# EAGLE design plugV15-pth (EAGLE 7.5.0)
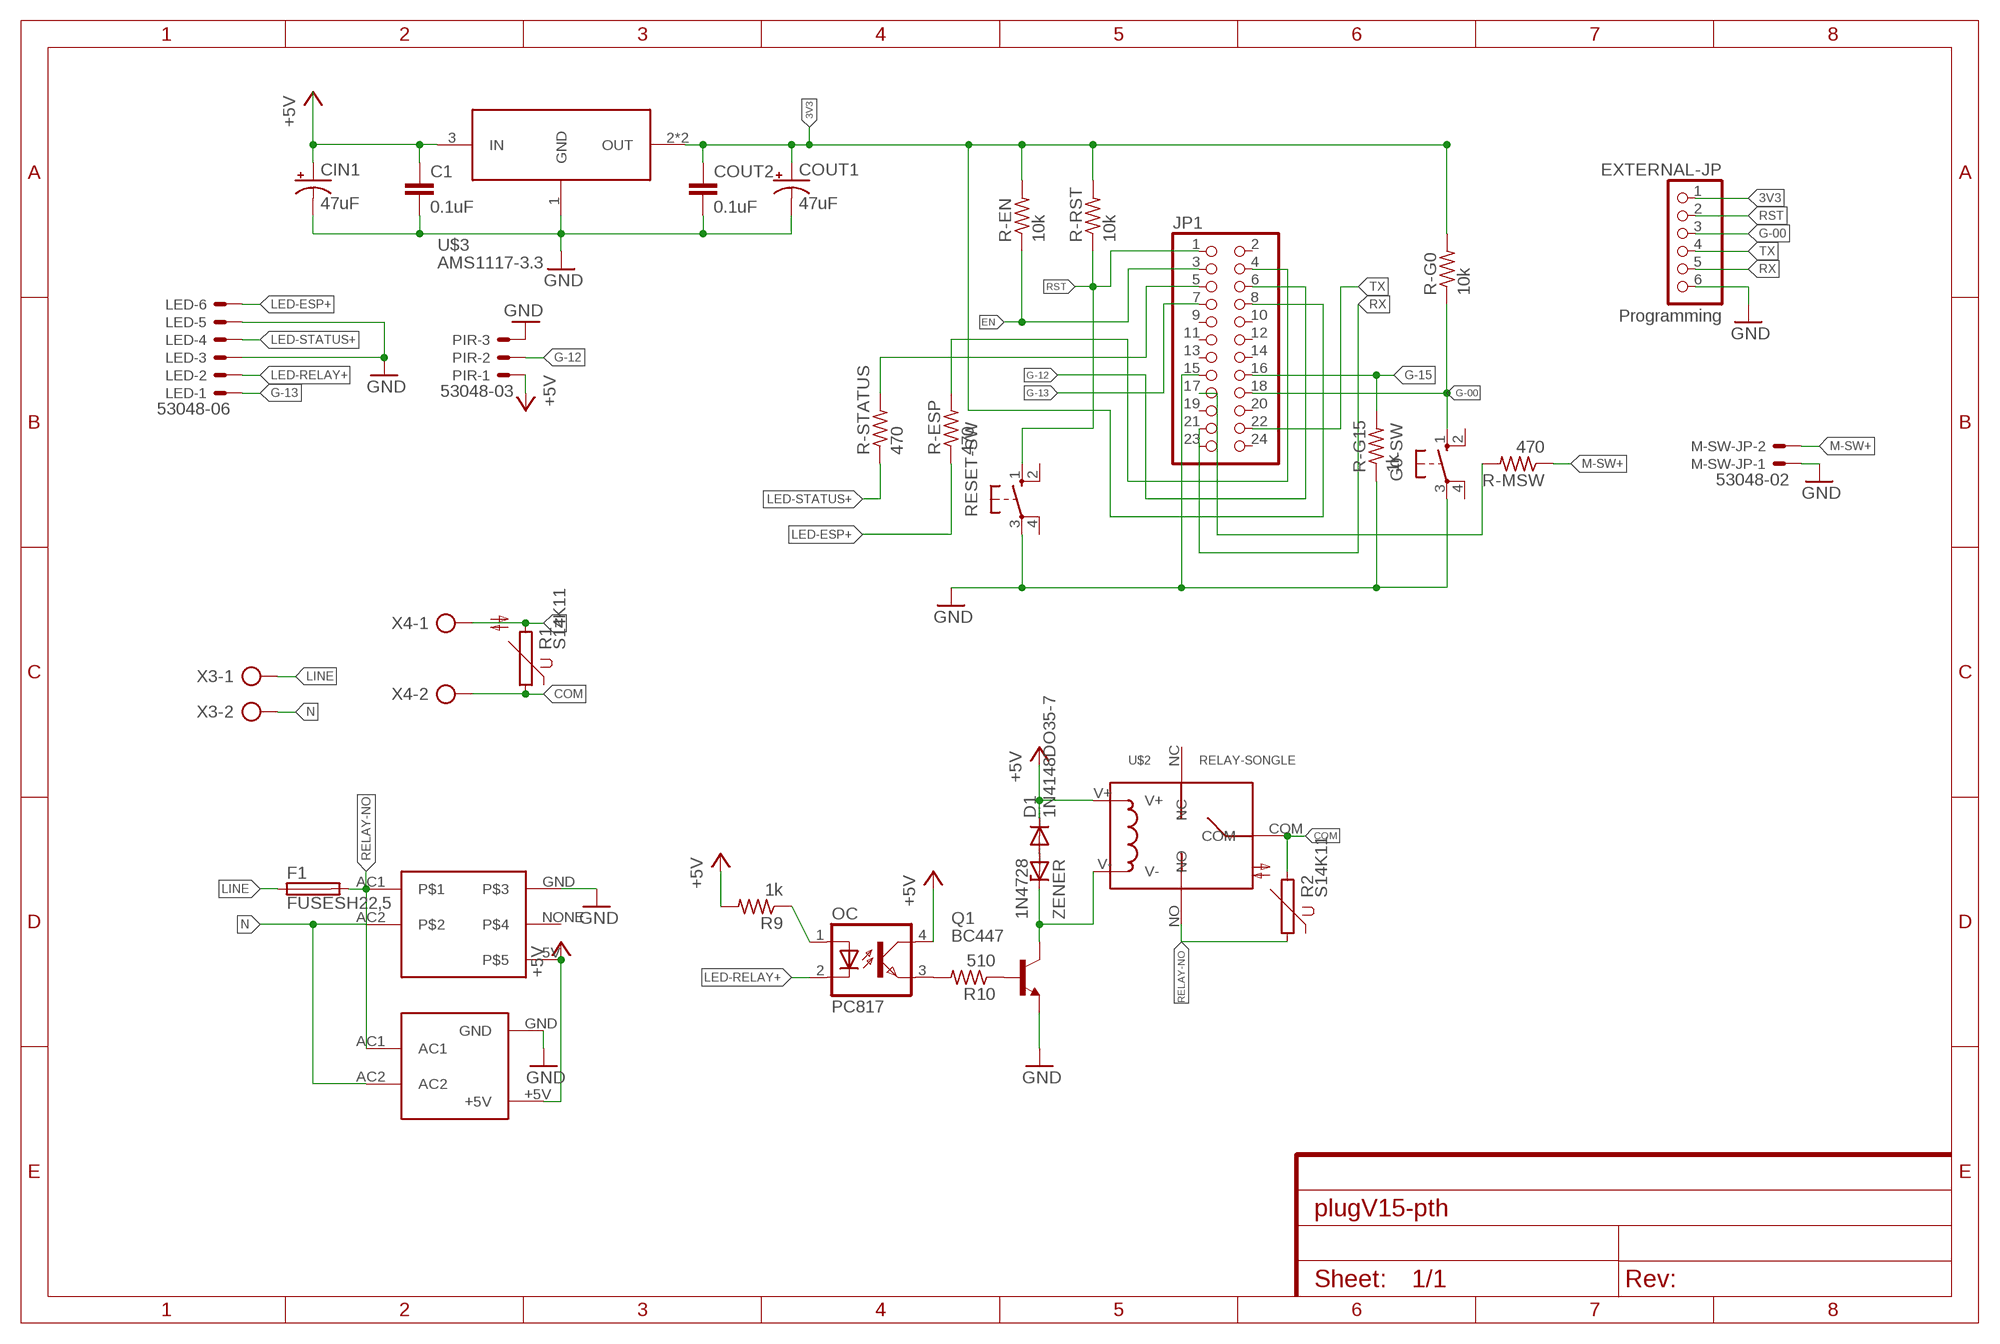
[diagram p0: schematic, sheet 1]

## Parts
C1  0.1uF  C-EU050-024X044  [C050-024X044]
CIN1  47uF  CPOL-USE2.5-5  [E2,5-5]
COUT1  47uF  CPOL-USE2.5-5  [E2,5-5]
COUT2  0.1uF  C-EU050-024X044  [C050-024X044]
D1  1N4148DO35-7  [DO35-7]
EXTERNAL-JP  Programming  PINHD-1X6  [1X06]
F1  FUSESH22,5  [SH22,5]
G0-SW  10-XX  [B3F-10XX]
JP1  PINHD-2X12  [2X12]
LED  53048-06  [53048-06]
M-SW-JP  53048-02  [53048-02]
OC  PC817  [DIL04]
PIR  53048-03  [53048-03]
Q1  BC447  [TO92-EBC]
R1  S14K11  [S14K11]
R2  S14K11  [S14K11]
R9  1k  R-US_0207/10  [0207/10]
R10  510  R-US_0207/10  [0207/10]
R-EN  10k  R-US_0207/10  [0207/10]
R-ESP  470  R-US_0207/10  [0207/10]
R-G0  10k  R-US_0207/10  [0207/10]
R-G15  1k  R-US_0207/10  [0207/10]
R-MSW  470  R-US_0207/10  [0207/10]
R-RST  10k  R-US_0207/10  [0207/10]
R-STATUS  470  R-US_0207/10  [0207/10]
RESET-SW  10-XX  [B3F-10XX]
U$1  HLK-PM01  [HLK-PM01]
U$2  RELAY-SONGLE  [RELAY-SONGLE]
U$3  AMS1117-3.3  [SOT-223]
U$4  POWERSUPPLY-5V-700MA  [POWERSUPPLY-5V-700MA]
X3  AK300/2  [AK300/2]
X4  AK300/2  [AK300/2]
ZENER  1N4728  [DO41Z10]

## Nets
3V3: COUT1.+ COUT2.1 EXTERNAL-JP.1 JP1.8 R-EN.2 R-G0.2 R-RST.2 U$3.2(OUT) U$3.4(OUT)
+5V: C1.1 CIN1.+ D1.C OC.4(COL) PIR.1 R9.2 U$1.+5V U$2.V+ U$3.3(IN) U$4.5V
COM: R1.1 R2.2 U$2.COM X4.2
EN: JP1.3 R-EN.1
G-00: EXTERNAL-JP.3 G0-SW.1(S) JP1.18 R-G0.1
G-12: JP1.6 PIR.2
G-13: JP1.7 LED.1
G-15: JP1.16 R-G15.2
GND: C1.2 CIN1.- COUT1.- COUT2.2 EXTERNAL-JP.6 G0-SW.3(P) JP1.15 LED.3 LED.5 M-SW-JP.1 PIR.3 Q1.E R-G15.1 RESET-SW.3(P) U$1.GND U$3.1(GND) U$4.GND
LED-ESP+: LED.6 R-ESP.1
LED-RELAY+: LED.2 OC.2(C)
LED-STATUS+: LED.4 R-STATUS.1
LINE: F1.1 X3.1
M-SW+: M-SW-JP.2 R-MSW.1
N: R1.2 U$1.AC2 U$4.AC2 X3.2 X4.1
N$1: OC.3(EMIT) R10.2
N$2: Q1.B R10.1
N$4: JP1.4 R-ESP.2
N$7: JP1.17 R-MSW.2
N$8: JP1.5 R-STATUS.2
N$13: OC.1(A) R9.1
N$16: D1.A ZENER.A
N$17: Q1.C U$2.V- ZENER.C
RELAY-NO: F1.2 R2.1 U$1.AC1 U$2.NO U$4.AC1
RST: EXTERNAL-JP.2 JP1.1 R-RST.1 RESET-SW.1(S)
RX: EXTERNAL-JP.5 JP1.21
TX: EXTERNAL-JP.4 JP1.22
Unconnected: G0-SW.2(S1) G0-SW.4(P1) JP1.2 JP1.9 JP1.10 JP1.11 JP1.12 JP1.13 JP1.14 JP1.19 JP1.20 JP1.23 JP1.24 RESET-SW.2(S1) RESET-SW.4(P1) U$2.NC U$4.NONE

## Library data of the parts
C1 COUT2 = rcl:C-EU: CAPACITOR, European symbol
CIN1 COUT1 = rcl:CPOL-US: POLARIZED CAPACITOR, American symbol
D1 = diode:1N4148: DIODE high speed (Philips)
EXTERNAL-JP = pinhead:PINHD-1X6: PIN HEADER
F1 = fuse:FUSE: Fuse; OC_FARNELL: unknown; OC_NEWARK: unknown
G0-SW RESET-SW = switch-omron:10-XX: OMRON SWITCH; MPN: B3F-1000; OC_FARNELL: 176432; OC_NEWARK: 36M3542
JP1 = pinhead:PINHD-2X12: PIN HEADER
LED = con-molex:53?-06: CONNECTOR wire to board 1.25 mm (.049 inch) pitch header; MF: WALDOM/MOLEX; MPN: 53048-0610; OC_FARNELL: 1012260; OC_NEWARK: 38C9911
M-SW-JP = con-molex:53?-02: CONNECTOR wire to board 1.25 mm (.049 inch) pitch header; MF: MOLEX; MPN: 53048-0210; OC_FARNELL: 1012259; OC_NEWARK: 57H4718
OC = optocoupler:PC817: SHARP OPTO COUPLER; MPN: PC817X4J000F; OC_FARNELL: 9707727; OC_NEWARK: 97K7059
PIR = con-molex:53?-03: CONNECTOR wire to board 1.25 mm (.049 inch) pitch header; MF: WALDOM/MOLEX; MPN: 53048-0310; OC_FARNELL: 9732918; OC_NEWARK: 38C9908
Q1 = transistor-npn:BC447*: NPN Transistor
R1 R2 = varistor:S14K11: VARISTOR
R9 R10 R-EN R-ESP R-G0 R-G15 R-MSW R-RST R-STATUS = rcl:R-US_: RESISTOR, American symbol
U$1 = HLK-PM01:HLK-PM01
U$2 = Seeed-OPL-Relay:RELAY-SONGLE
U$3 = AMS1117-3.3:AMS1117-3.3: 1A LOW DROPOUT VOLTAGE REGULATOR
U$4 = PowerSupply-5V-700mA:POWERSUPPLY-5V-700MA
X3 X4 = con-ptr500:AK300/2: CONNECTOR; OC_FARNELL: unknown; OC_NEWARK: unknown
ZENER = diode:1N4728: Z DIODE 3.3 V, 1W, 5 percent

## Net classes
0 default: width 0.305 mm
1 tong: width 0.61 mm

## Board
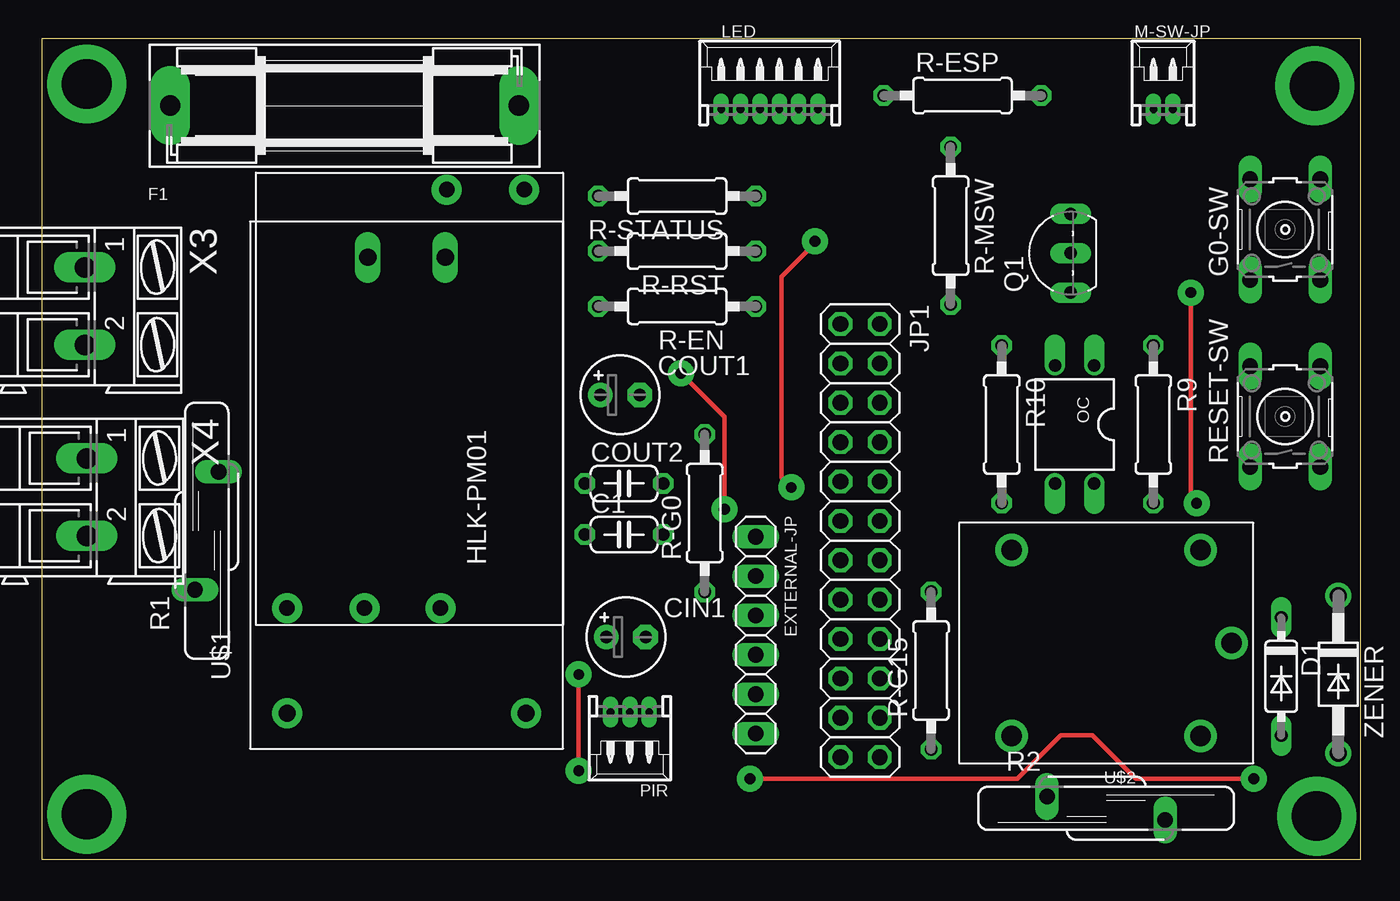
[diagram p1: board, top side]
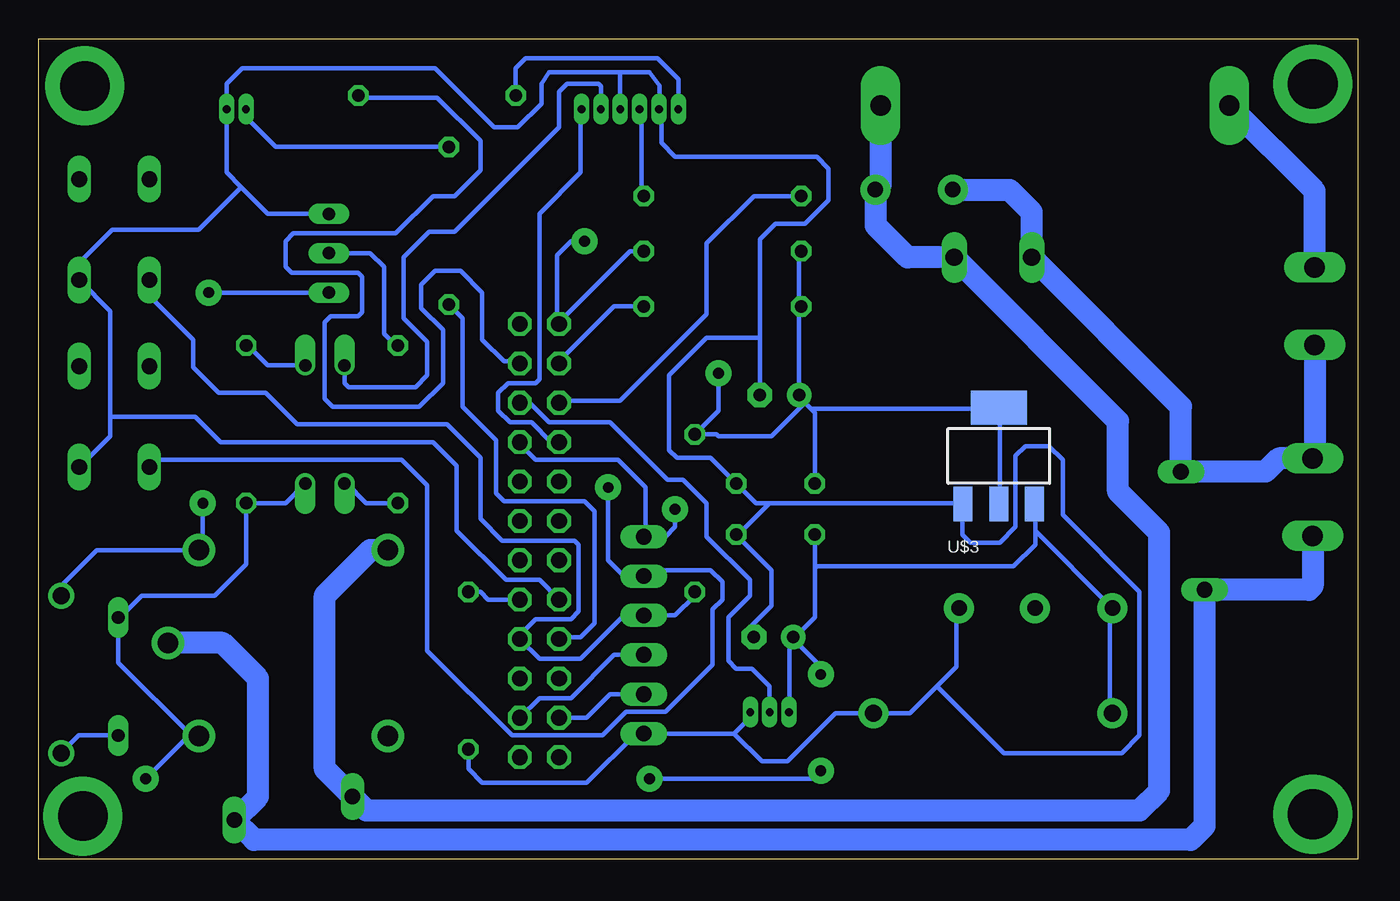
[diagram p2: board, bottom side, seen from below]

Size 85.14 x 52.95 mm. Coordinates in mm from the lower left corner, seen from the top.
Outline: 0,0 85.14,0 85.14,52.95 0,52.95 0,0
Copper layers (1*16): Top 0.035mm / dielectric 1.5mm / Bottom 0.035mm
Design rules "default": minimum track width 10mil, minimum drill 24mil, track to track 8mil, track to pad 8mil, pad to pad 8mil, via to via 8mil, smd to smd 8mil, copper to edge 40mil, drill to drill 8mil, minimum pad ring 10mil, minimum via ring 8mil, stop-mask expansion 4mil, vias tented up to drill 0mil, thermal gap 10mil

### Footprints (pad centres in the part's own frame; a part is rotated, then mirrored left to right if it is on the bottom)
C050-024X044 = drill 0.813 octagon: 1 -2.54,0; 2 2.54,0
E2,5-5 = drill 0.813 pad 1.6: + -1.27,0 | drill 0.813 pad 1.6 octagon: - 1.27,0
DO35-7 = drill 0.813 long: A 3.81,0; C -3.81,0
1X06 = drill 1.016 long: 1 -6.35,0; 2 -3.81,0; 3 -1.27,0; 4 1.27,0; 5 3.81,0; 6 6.35,0
SH22,5 = drill 1.321 pad 2.54 long: 1 -11.252,0; 2 11.252,0
B3F-10XX = drill 1.016 long: 1 -3.251,2.261; 2 3.251,2.261; 3 -3.251,-2.261; 4 3.251,-2.261
2X12 = drill 1.016 octagon: 1 -13.97,-1.27; 2 -13.97,1.27; 3 -11.43,-1.27; 4 -11.43,1.27; 5 -8.89,-1.27; 6 -8.89,1.27; 7 -6.35,-1.27; 8 -6.35,1.27; 9 -3.81,-1.27; 10 -3.81,1.27; 11 -1.27,-1.27; 12 -1.27,1.27; 13 1.27,-1.27; 14 1.27,1.27; 15 3.81,-1.27; 16 3.81,1.27; 17 6.35,-1.27; 18 6.35,1.27; 19 8.89,-1.27; 20 8.89,1.27; 21 11.43,-1.27; 22 11.43,1.27; 23 13.97,-1.27; 24 13.97,1.27
53048-06 = drill 0.5 pad 0.698 long: 1 3.125,-1.25; 2 1.875,-1.25; 3 0.625,-1.25; 4 -0.625,-1.25; 5 -1.875,-1.25; 6 -3.125,-1.25
53048-02 = drill 0.5 pad 0.698 long: 1 0.625,-1.25; 2 -0.625,-1.25
DIL04 = drill 0.813 offset: 1 -1.27,-3.81; 2 1.27,-3.81; 3 1.27,3.81; 4 -1.27,3.81
53048-03 = drill 0.5 pad 0.698 long: 1 1.25,-1.25; 2 0,-1.25; 3 -1.25,-1.25
TO92-EBC = drill 0.813 long: B 0,-1.27; C -2.54,-1.27; E 2.54,-1.27
S14K11 = drill 1.016 long: 1 -0.762,-3.81; 2 0.762,3.81
0207/10 = drill 0.813 octagon: 1 -5.08,0; 2 5.08,0
HLK-PM01 = drill 1.1 pad 1.93: +5V 15.19,-7.76; GND 15.19,7.64 | drill 1.1 long: AC1 -14.21,2.44; AC2 -14.21,-2.56
RELAY-SONGLE = drill 1.3 pad 2.1: COM -8.1,0; NC 6.1,6; NO 6.1,-6; V+ -6.1,6; V- -6.1,-6
SOT-223 = smd 1.219 x 2.235: 1 -2.381,-3.099; 2 -0.07,-3.099; 3 2.241,-3.099 | smd 3.6 x 2.2: 4 -0.07,3.099
POWERSUPPLY-5V-700MA = drill 1 pad 1.93: 5V 13.5,-7.9; AC1 -13.5,7.4; AC2 -13.5,2.4; GND 13.5,2; NONE 13.5,-2.9
AK300/2 = drill 1.321 long: 1 -2.515,0; 2 2.489,0
DO41Z10 = drill 1.118: A 5.08,0; C -5.08,0

### Placement (x,y rotation side)
C1  37.59,20.95 0 top
CIN1  37.72,14.35 0 top
COUT1  37.34,29.97 0 top
COUT2  37.59,24.26 0 top
D1  80.01,11.81 270 top
EXTERNAL-JP  46.1,14.48 270 top
F1  19.56,48.64 0 top
G0-SW  80.26,40.64 90 top
JP1  52.83,20.57 270 top
LED  46.99,49.66 0 top
M-SW-JP  72.39,49.66 0 top
OC  66.67,28.07 180 top
PIR  37.97,8.25 180 top
Q1  65.15,39.12 90 top
R1  10.67,21.21 0 top
R2  68.71,3.3 270 top
R9  71.75,28.07 270 top
R10  61.98,28.07 270 top
R-EN  41.02,35.69 180 top
R-ESP  59.44,49.28 0 top
R-G0  42.8,22.35 90 top
R-G15  57.4,12.19 90 top
R-MSW  58.67,40.89 270 top
R-RST  41.02,39.24 180 top
R-STATUS  41.02,42.8 180 top
RESET-SW  80.26,28.57 90 top
U$1  23.62,24.64 270 top
U$2  68.71,13.97 180 top
U$3  23.11,26.04 0 bottom
U$4  23.75,29.72 270 top
X3  2.79,35.69 270 top
X4  2.92,23.37 270 top
ZENER  83.69,11.94 270 top

### Tracks (layer width: path | path; a pad name or v marks a point on that pad's centre or on a via)
3V3  (via drill 0.7 pad 1.68)
  Top 0.305: v44.07,22.61 44.07,28.57 v41.27,31.37
  Bottom 0.305: U$3.2 23.11,22.99 23.11,29.08 U$3.4 23.37,29.08 35.31,29.08 | 36.07,35.69 36.07,39.24 R-RST.2 | COUT2.1 35.05,28.83 35.31,29.08 | 35.69,29.46 36.07,29.84 COUT1.+ 36.07,35.69 | 35.69,29.46 35.31,29.08 | 36.07,35.69 R-EN.2 | 35.69,29.46 37.85,27.3 41.27,27.3 41.4,27.43 R-G0.2 41.27,28.96 v41.27,31.37 | JP1.8 54.1,26.8 53.09,25.78 47.75,25.78 45.97,24 45.97,20.95 EXTERNAL-JP.1 44.7,20.83 44.07,21.46 v44.07,22.61
+5V  (via drill 0.7 pad 1.68)
  Top 0.305: v34.67,11.94 v34.67,5.71 | v45.72,5.21 62.99,5.21 65.79,8 67.82,8 70.61,5.21 v78.23,5.21
  Bottom 0.305: CIN1.+ 36.58,14.35 34.67,12.45 v34.67,11.94 | 35.05,18.8 35.05,15.62 36.32,14.35 CIN1.+ | 35.05,18.8 C1.1 | 20.83,21.21 20.83,22.73 U$3.3 | 20.83,21.21 16,16.38 U$4.5V 16,16.13 16,9.52 U$1.+5V | v34.67,5.71 35.18,5.21 v45.72,5.21 | v78.23,5.21 75.47,7.97 U$2.V+ 75.28,7.97 80.01,12.7 D1.C 79.88,15.62 78.49,17.02 73.79,17.02 71.75,19.05 R9.2 69.22,22.99 OC.4 | PIR.1 36.7,9.52 36.7,13.72 36.45,13.97 CIN1.+ | 20.83,21.21 20.83,20.32 22.23,18.92 34.92,18.92 35.05,18.8
COM
  Bottom 1.422: X4.2 2.92,17.65 3.17,17.4 R1.1 9.91,2.16 10.79,1.27 71.25,1.27 R2.2 70.99,4.06 70.99,11.68 73.28,13.97 U$2.COM
EN
  Bottom 0.305: R-EN.1 48.01,35.69 51.56,32.13 JP1.3
G-00
  Bottom 0.305: G0-SW.1 77.98,37.36 77.98,36.32 75.18,33.53 75.18,31.75 73.53,30.1 70.48,30.1 68.45,28.07 58.8,28.07 56.64,25.91 56.64,21.97 55.24,20.57 50.55,20.57 50.29,20.32 50.29,16 50.8,15.49 53.09,15.49 54.1,14.48 JP1.18 52.83,12.95 50.16,12.95 47.37,15.75 EXTERNAL-JP.3 44.07,15.75 42.8,17.02 R-G0.1
G-12
  Bottom 0.305: PIR.2 37.97,11.18 39.12,12.32 40.13,12.32 40.64,12.83 40.64,15.62 39.24,17.02 39.24,18.03 42.04,20.83 42.04,22.99 43.56,24.51 44.58,24.51 48.26,28.19 52.2,28.19 53.47,29.46 JP1.6
G-13
  Bottom 0.305: 50.29,48.39 LED.1 50.16,48.36 50.16,44.32 52.83,41.66 52.83,30.99 53.09,30.73 54.86,30.73 55.5,30.1 55.5,28.96 54.74,28.19 53.34,28.19 52.07,26.92 JP1.7
G-15
  Bottom 0.305: JP1.16 56.13,16.76 56.64,17.27 R-G15.2
GND
  Bottom 0.305: 40.26,8.13 EXTERNAL-JP.6 46.61,8.13 49.78,4.95 56.52,4.95 57.4,5.84 R-G15.1 | 40.26,8.13 39.37,9.02 | 39.37,9.02 39.22,9.16 PIR.3 39.37,9.02 | 72.9,48.39 M-SW-JP.1 | RESET-SW.3 82.3,25.53 80.52,27.3 80.52,28.57 | 80.52,28.57 80.52,35.38 G0-SW.3 82.53,38.51 80.39,40.64 74.8,40.64 72.07,43.37 | COUT1.- 38.61,33.66 | 38.61,33.66 38.61,40.01 37.59,41.02 35.69,41.02 34.16,42.55 34.16,44.58 34.92,45.34 44.07,45.34 44.96,46.23 44.96,48.39 LED.5 45.09,48.44 45.09,49.91 45.72,50.8 47.62,50.8 | U$4.GND 25.91,16.13 25.91,12.45 27.18,11.18 | 37.97,22.99 38.86,22.99 COUT2.2 41.78,25.91 43.94,25.91 44.45,26.42 44.45,31.24 42.04,33.66 38.61,33.66 | 37.97,22.99 25.65,22.99 U$3.1 | CIN1.- 39.12,14.35 39.12,15.11 37.85,16.38 37.85,18.67 C1.2 40.01,20.95 37.97,22.99 | 25.4,22.73 U$3.1 | 27.18,11.18 28.91,9.45 U$1.GND 33.73,9.45 36.83,6.35 38.48,6.35 40.26,8.13 | 27.18,11.18 22.86,6.86 15.24,6.86 14.1,8 14.1,17.27 19.05,22.22 19.05,25.78 19.94,26.67 21.46,26.67 22.1,26.04 22.1,21.46 23.11,20.45 25.02,20.45 25.53,20.95 25.53,22.9 U$3.1 | JP1.15 52.83,18.03 54.99,18.03 58.17,21.21 58.17,25.4 59.69,26.92 73.41,26.92 75.06,28.57 80.52,28.57 | 47.62,50.8 52.2,50.8 52.7,50.04 52.7,48.77 54.23,47.24 55.75,47.24 59.56,51.05 72.01,51.05 73.03,50.04 M-SW-JP.1 | LED.3 47.62,50.8 | Q1.E 70.36,41.66 72.07,43.37 | 72.07,43.37 73.03,44.32 73.03,48.4 M-SW-JP.1
LED-ESP+
  Bottom 0.305: LED.6 43.87,50.34 45.21,51.69 53.72,51.69 54.36,51.05 R-ESP.1
LED-RELAY+
  Bottom 0.305: LED.2 48.87,49.88 49.02,50.04 51.05,50.04 51.56,49.53 51.56,47.24 58.29,40.51 59.94,40.51 61.59,38.86 61.59,34.93 60.07,33.4 60.07,31.24 60.83,30.48 65.15,30.48 65.41,30.73 OC.2
LED-STATUS+
  Bottom 0.305: LED.4 46.23,48.39 46.23,42.8 R-STATUS.1
LINE
  Bottom 1.422: X3.1 2.79,43.13 F1.1
M-SW+
  Bottom 0.305: 71.63,48.39 M-SW-JP.2 71.77,47.89 69.85,45.97 R-MSW.1
N
  Bottom 1.422: U$4.AC2 26.11,43.18 22.48,43.18 21.06,41.76 U$1.AC2 11.43,29.22 R1.2 5.97,25.02 5.11,25.88 X4.1 2.79,26.01 X3.2
N$1
  Bottom 0.305: R10.2 64.01,22.99 65.28,24.26 OC.3
N$2
  Bottom 0.305: R10.1 62.1,33.15 62.87,33.91 62.87,38.23 63.75,39.12 Q1.B
N$3  (via drill 3.2 pad 5.08)
  other vias: 82.17,49.91
N$4
  Bottom 0.305: R-ESP.2 64.52,49.15 59.44,49.15 56.64,46.36 56.64,44.45 58.29,42.8 59.69,42.8 62.1,40.39 68.71,40.39 69.22,39.88 69.22,38.23 68.83,37.85 64.52,37.85 64.26,37.59 64.26,35.31 64.52,35.05 66.29,35.05 66.67,34.67 66.67,29.72 66.17,29.21 60.58,29.21 59.05,30.73 59.05,34.16 60.45,35.56 60.45,37.08 59.56,37.97 57.91,37.97 56.52,36.58 56.52,33.53 55.12,32.13 54.1,32.13 JP1.4
N$6  (via drill 3.2 pad 5.08)
  other vias: 82.3,2.79
N$7
  Bottom 0.305: JP1.17 51.56,14.35 50.16,14.35 49.28,15.24 49.28,22.48 49.91,23.11 55.12,23.11 55.63,23.62 55.63,27.05 57.78,29.21 57.78,34.93 R-MSW.2
N$8
  Bottom 0.305: JP1.5 51.56,29.59 47.62,29.59 42.04,35.18 42.04,39.75 38.99,42.8 R-STATUS.2
N$9  (via drill 3.2 pad 5.08)
  other vias: 2.92,2.92
N$13
  Bottom 0.305: OC.1 70.36,31.88 71.63,33.15 R9.1
N$16
  Bottom 0.305: D1.A 82.55,8 ZENER.A
N$17  (via drill 0.7 pad 1.68)
  Top 0.305: v74.55,22.99 74.17,23.37 v74.17,36.58
  Bottom 0.305: ZENER.C 83.69,17.65 81.41,19.94 74.84,19.94 U$2.V- 74.55,20.23 v74.55,22.99 | v74.17,36.58 Q1.C
N$18  (via drill 3.2 pad 5.08)
  other vias: 2.92,50.04
RELAY-NO
  Bottom 1.422: F1.2 30.81,43.56 U$4.AC1 31.11,43.18 31.11,40.89 29.07,38.85 U$1.AC1 15.49,28.28 15.49,23.75 12.83,21.08 12.83,4.45 14.1,3.17 64.01,3.17 R2.1 66.67,5.84 66.67,17.02 63.72,19.97 U$2.NO
RST  (via drill 0.7 pad 1.68)
  Top 0.305: v48.39,24 47.75,24.64 47.75,37.59 49.91,39.75 v49.91,39.88
  Bottom 0.305: R-RST.1 46.99,39.24 51.56,34.67 JP1.1 51.69,34.67 51.69,38.99 50.8,39.88 v49.91,39.88 | v48.39,24 48.39,19.3 47.37,18.29 EXTERNAL-JP.2 45.72,18.67 41.78,18.67 41.02,17.91 41.02,16.76 41.66,16.13 41.66,12.57 44.7,9.52 47.24,9.52 48.77,8 54.61,8 60.07,13.46 60.07,24.13 61.72,25.78 77.6,25.78 78,25.38 RESET-SW.1
RX
  Bottom 0.305: JP1.21 49.78,9.14 48.26,10.67 EXTERNAL-JP.5
TX
  Bottom 0.305: JP1.22 52.83,10.41 50.8,10.41 48.01,13.21 EXTERNAL-JP.4